# Altium schematic sheet Lights.SchDoc: LEDs
size A3; SheetNumber: 4; SheetTotal: 7
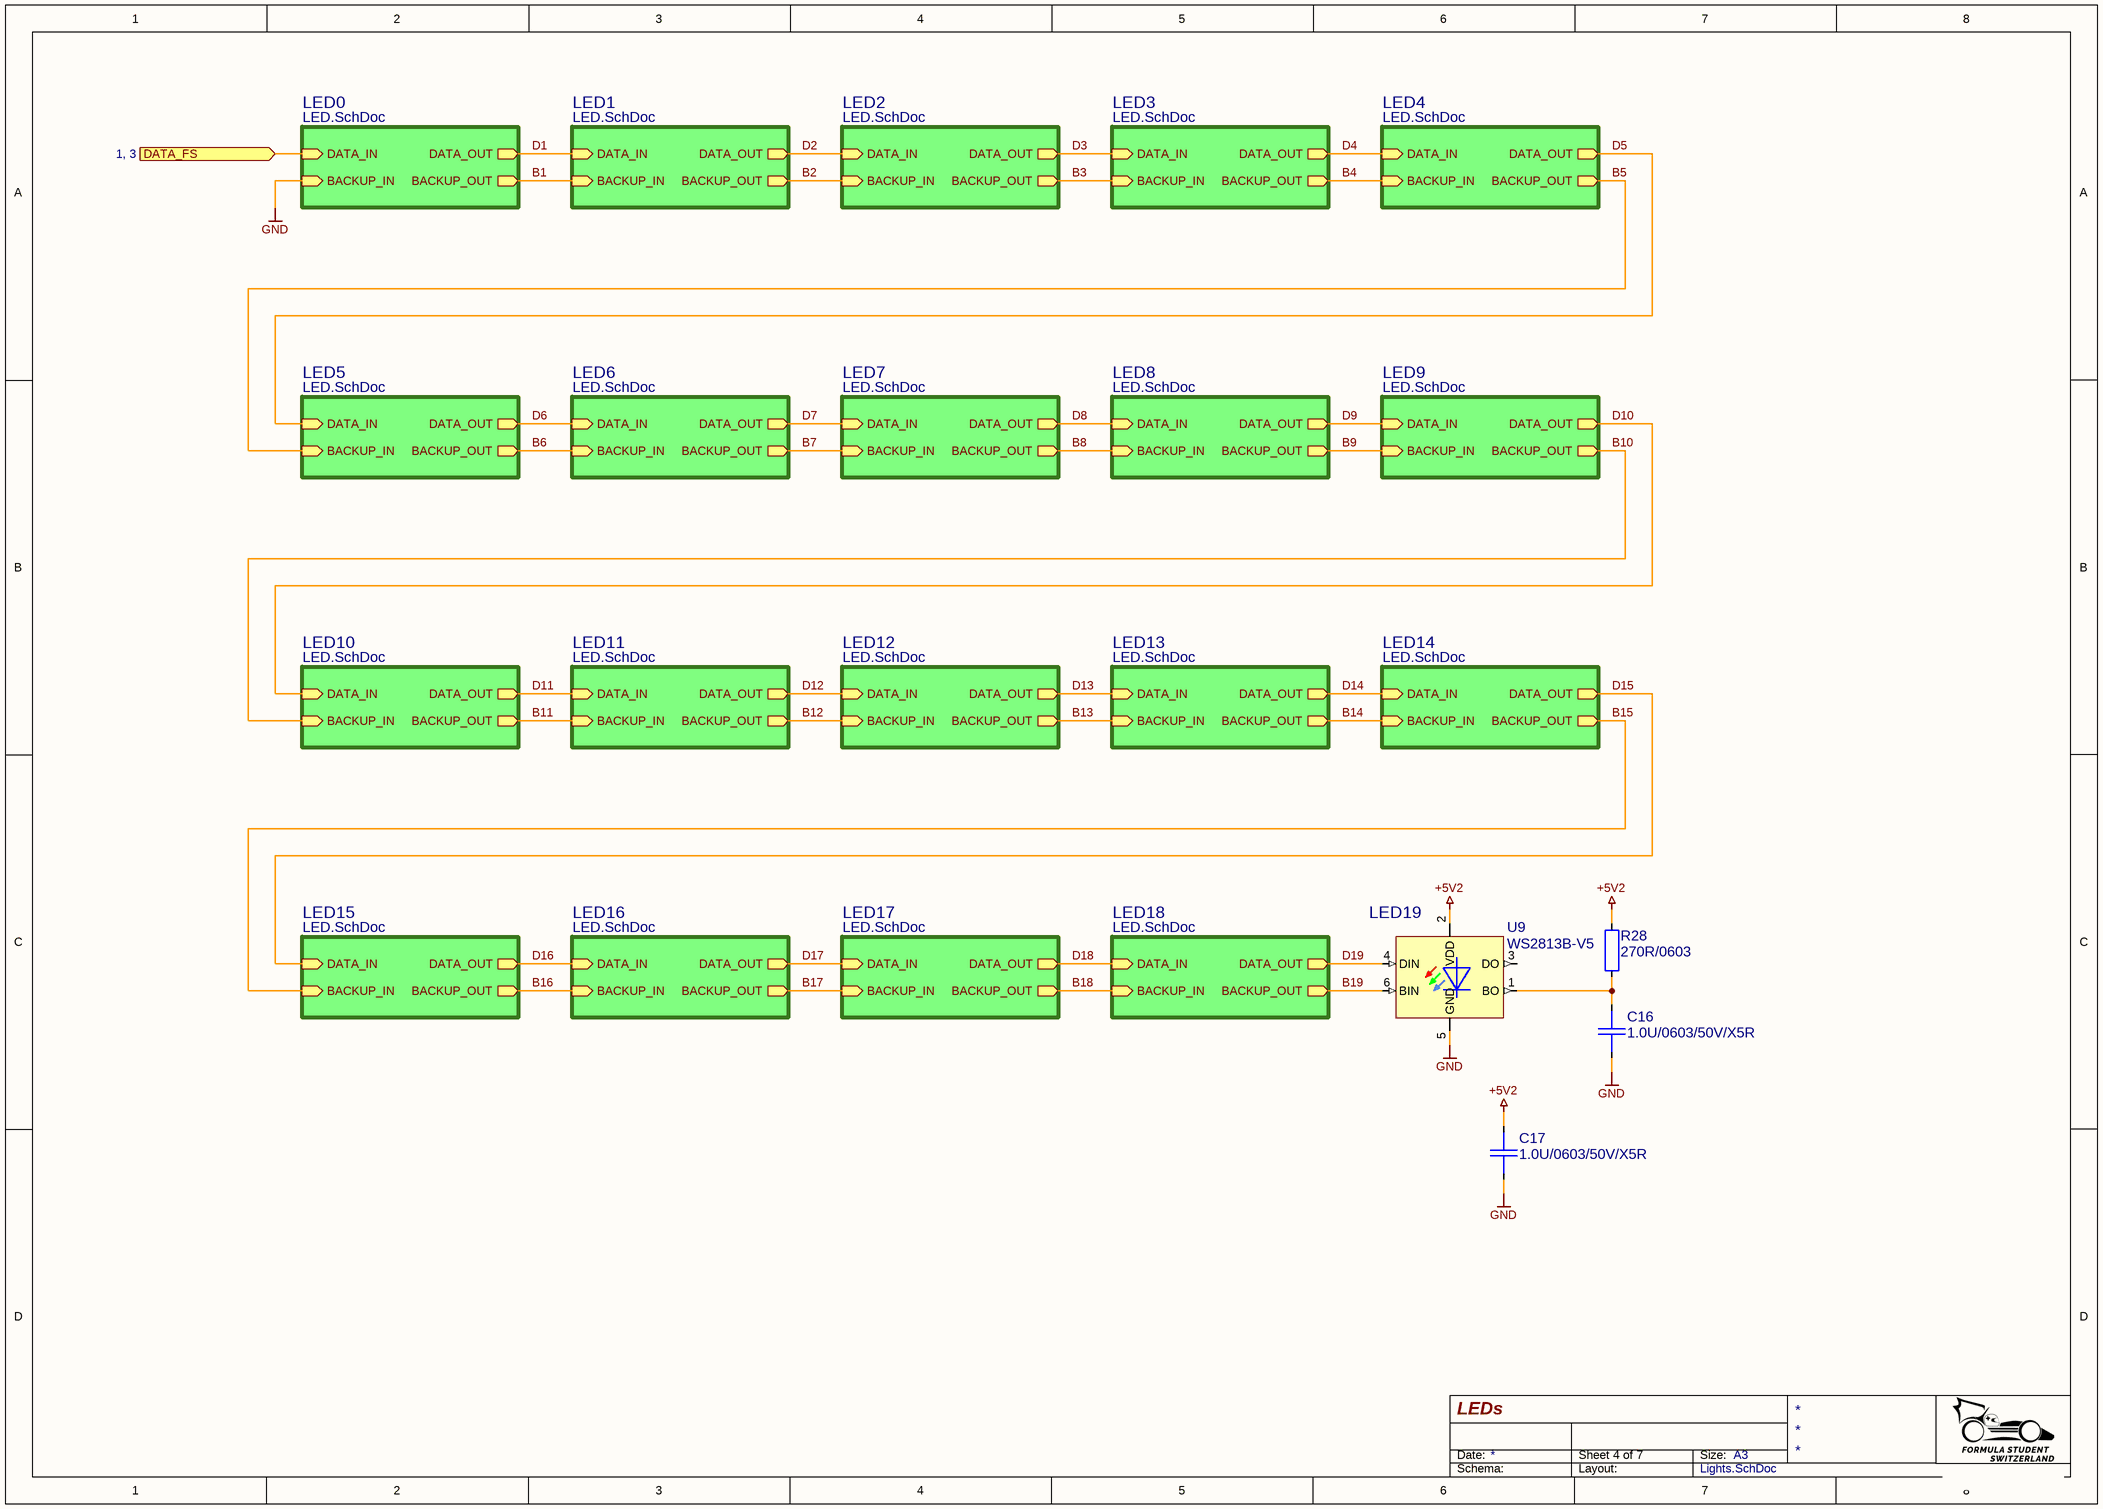
[diagram p0: Lights.SchDoc]

## Parts
C16  1.0U/0603/50V/X5R  [CAP0603_X7R]
C17  1.0U/0603/50V/X5R  [CAP0603_X7R]
R28  270R/0603  [R0603-0.40-WW]
U9  WS2813B-V5  [LEDM5050X165-6-SE]

## Sub-sheets
LED0 = LED.SchDoc: DATA_IN (in), BACKUP_IN (in), DATA_OUT (out), BACKUP_OUT (out)
LED1 = LED.SchDoc: DATA_IN (in), BACKUP_IN (in), DATA_OUT (out), BACKUP_OUT (out)
LED2 = LED.SchDoc: DATA_IN (in), BACKUP_IN (in), DATA_OUT (out), BACKUP_OUT (out)
LED3 = LED.SchDoc: DATA_IN (in), BACKUP_IN (in), DATA_OUT (out), BACKUP_OUT (out)
LED4 = LED.SchDoc: DATA_IN (in), BACKUP_IN (in), DATA_OUT (out), BACKUP_OUT (out)
LED5 = LED.SchDoc: DATA_IN (in), BACKUP_IN (in), DATA_OUT (out), BACKUP_OUT (out)
LED6 = LED.SchDoc: DATA_IN (in), BACKUP_IN (in), DATA_OUT (out), BACKUP_OUT (out)
LED7 = LED.SchDoc: DATA_IN (in), BACKUP_IN (in), DATA_OUT (out), BACKUP_OUT (out)
LED8 = LED.SchDoc: DATA_IN (in), BACKUP_IN (in), DATA_OUT (out), BACKUP_OUT (out)
LED9 = LED.SchDoc: DATA_IN (in), BACKUP_IN (in), DATA_OUT (out), BACKUP_OUT (out)
LED10 = LED.SchDoc: DATA_IN (in), BACKUP_IN (in), DATA_OUT (out), BACKUP_OUT (out)
LED11 = LED.SchDoc: DATA_IN (in), BACKUP_IN (in), DATA_OUT (out), BACKUP_OUT (out)
LED12 = LED.SchDoc: DATA_IN (in), BACKUP_IN (in), DATA_OUT (out), BACKUP_OUT (out)
LED13 = LED.SchDoc: DATA_IN (in), BACKUP_IN (in), DATA_OUT (out), BACKUP_OUT (out)
LED14 = LED.SchDoc: DATA_IN (in), BACKUP_IN (in), DATA_OUT (out), BACKUP_OUT (out)
LED15 = LED.SchDoc: DATA_IN (in), BACKUP_IN (in), DATA_OUT (out), BACKUP_OUT (out)
LED16 = LED.SchDoc: DATA_IN (in), BACKUP_IN (in), DATA_OUT (out), BACKUP_OUT (out)
LED17 = LED.SchDoc: DATA_IN (in), BACKUP_IN (in), DATA_OUT (out), BACKUP_OUT (out)
LED18 = LED.SchDoc: DATA_IN (in), BACKUP_IN (in), DATA_OUT (out), BACKUP_OUT (out)

## Ports
DATA_FS (in, see 1, 3)

## Nets
+5V2: C17.1 R28.1 U9.2(VDD)
GND: C16.2 C17.2 U9.5(GND) ; sheet LED0/BACKUP_IN
B1: sheet LED0/BACKUP_OUT, sheet LED1/BACKUP_IN
B2: sheet LED1/BACKUP_OUT, sheet LED2/BACKUP_IN
B3: sheet LED2/BACKUP_OUT, sheet LED3/BACKUP_IN
B4: sheet LED3/BACKUP_OUT, sheet LED4/BACKUP_IN
B5: sheet LED4/BACKUP_OUT, sheet LED5/BACKUP_IN
B6: sheet LED5/BACKUP_OUT, sheet LED6/BACKUP_IN
B7: sheet LED6/BACKUP_OUT, sheet LED7/BACKUP_IN
B8: sheet LED7/BACKUP_OUT, sheet LED8/BACKUP_IN
B9: sheet LED8/BACKUP_OUT, sheet LED9/BACKUP_IN
B10: sheet LED9/BACKUP_OUT, sheet LED10/BACKUP_IN
B11: sheet LED10/BACKUP_OUT, sheet LED11/BACKUP_IN
B12: sheet LED11/BACKUP_OUT, sheet LED12/BACKUP_IN
B13: sheet LED12/BACKUP_OUT, sheet LED13/BACKUP_IN
B14: sheet LED13/BACKUP_OUT, sheet LED14/BACKUP_IN
B15: sheet LED14/BACKUP_OUT, sheet LED15/BACKUP_IN
B16: sheet LED15/BACKUP_OUT, sheet LED16/BACKUP_IN
B17: sheet LED16/BACKUP_OUT, sheet LED17/BACKUP_IN
B18: sheet LED17/BACKUP_OUT, sheet LED18/BACKUP_IN
B19: U9.6(BIN) ; sheet LED18/BACKUP_OUT
D1: sheet LED0/DATA_OUT, sheet LED1/DATA_IN
D2: sheet LED1/DATA_OUT, sheet LED2/DATA_IN
D3: sheet LED2/DATA_OUT, sheet LED3/DATA_IN
D4: sheet LED3/DATA_OUT, sheet LED4/DATA_IN
D5: sheet LED4/DATA_OUT, sheet LED5/DATA_IN
D6: sheet LED5/DATA_OUT, sheet LED6/DATA_IN
D7: sheet LED6/DATA_OUT, sheet LED7/DATA_IN
D8: sheet LED7/DATA_OUT, sheet LED8/DATA_IN
D9: sheet LED8/DATA_OUT, sheet LED9/DATA_IN
D10: sheet LED9/DATA_OUT, sheet LED10/DATA_IN
D11: sheet LED10/DATA_OUT, sheet LED11/DATA_IN
D12: sheet LED11/DATA_OUT, sheet LED12/DATA_IN
D13: sheet LED12/DATA_OUT, sheet LED13/DATA_IN
D14: sheet LED13/DATA_OUT, sheet LED14/DATA_IN
D15: sheet LED14/DATA_OUT, sheet LED15/DATA_IN
D16: sheet LED15/DATA_OUT, sheet LED16/DATA_IN
D17: sheet LED16/DATA_OUT, sheet LED17/DATA_IN
D18: sheet LED17/DATA_OUT, sheet LED18/DATA_IN
D19: U9.4(DIN) ; sheet LED18/DATA_OUT
DATA_FS: port DATA_FS, sheet LED0/DATA_IN
NetC16_1: C16.1 R28.2 U9.1(BO)

Not connected (* = marked no-connect by the designer): U9 3(DO)

## Notes on the sheet
- (near U9) LED19
- Date:
- Size:
- A3
- Schema:
- Layout:

## Library data of the parts
C16 C17 = 1.0U/0603/50V/X5R: CAP SM 0603 1.0uF 50V X5R; Manufacturer: GENERIC; Manufacturer 1: Samsung Electro-Mechanics; Manufacturer Part Number 1: CL10A105KB8NNNC; Absolute Value: 1E-6; Eurocircuits GPN: GPC0603105-X5R; Part Number: 1.0U/0603/50V/X5R; Package: 0603; Value: 1.0uF; HelpURL: https://mm.digikey.com/Volume0/opasdata/d220001/medias/docus/658/CL10A105KB8NNNC_Spec.pdf; Supplier 1: Digi-Key; Supplier Part Number 1: 1276-1860-1-ND; Manufacturer Part Number 3: CL10A105KB8NNNC; Supplier 3: LCSC; Supplier Part Number 3: C15849; JLC Type: Basic
R28 = 270R/0603: RES SM 0603 270R; Manufacturer: GENERIC; Manufacturer 1: YAGEO; Manufacturer Part Number 1: RC0603FR-13270RL; Absolute Value: 270; Part Number: 270R/0603; Package: 0603; Value: 270R; HelpURL: https://www.yageo.com/upload/media/product/productsearch/datasheet/rchip/PYu-RC_Group_51_RoHS_L_12.pdf; Supplier 1: Digi-Key; Supplier Part Number 1: 13-RC0603FR-13270RLCT-ND; Manufacturer 2: YAGEO; Manufacturer Part Number 2: RC0603FR-10270RL; Supplier 2: Digi-Key; Supplier Part Number 2: 13-RC0603FR-10270RLCT-ND; Manufacturer 3: UNI-ROYAL(Uniroyal Elec); Manufacturer Part Number 3: 0603WAF2700T5E; Supplier 3: LCSC; Supplier Part Number 3: C22966; JLC Type: Basic
U9 = WS2813B-V5: Intelligent control LED integrated light source with backup Pin; Manufacturer: WorldSemi; Part Number: WS2813B-V5; Package: SMD5050; HelpURL: https://datasheet.lcsc.com/lcsc/2012110135_Worldsemi-WS2813B-V5_C965558.pdf; Manufacturer 3: WorldSemi; Manufacturer Part Number 3: WS2813B-V5; Supplier 3: LCSC; Supplier Part Number 3: C965558; JLC Type: Extended